# EAGLE schematic Stellmotor_lpc (EAGLE 5.06)
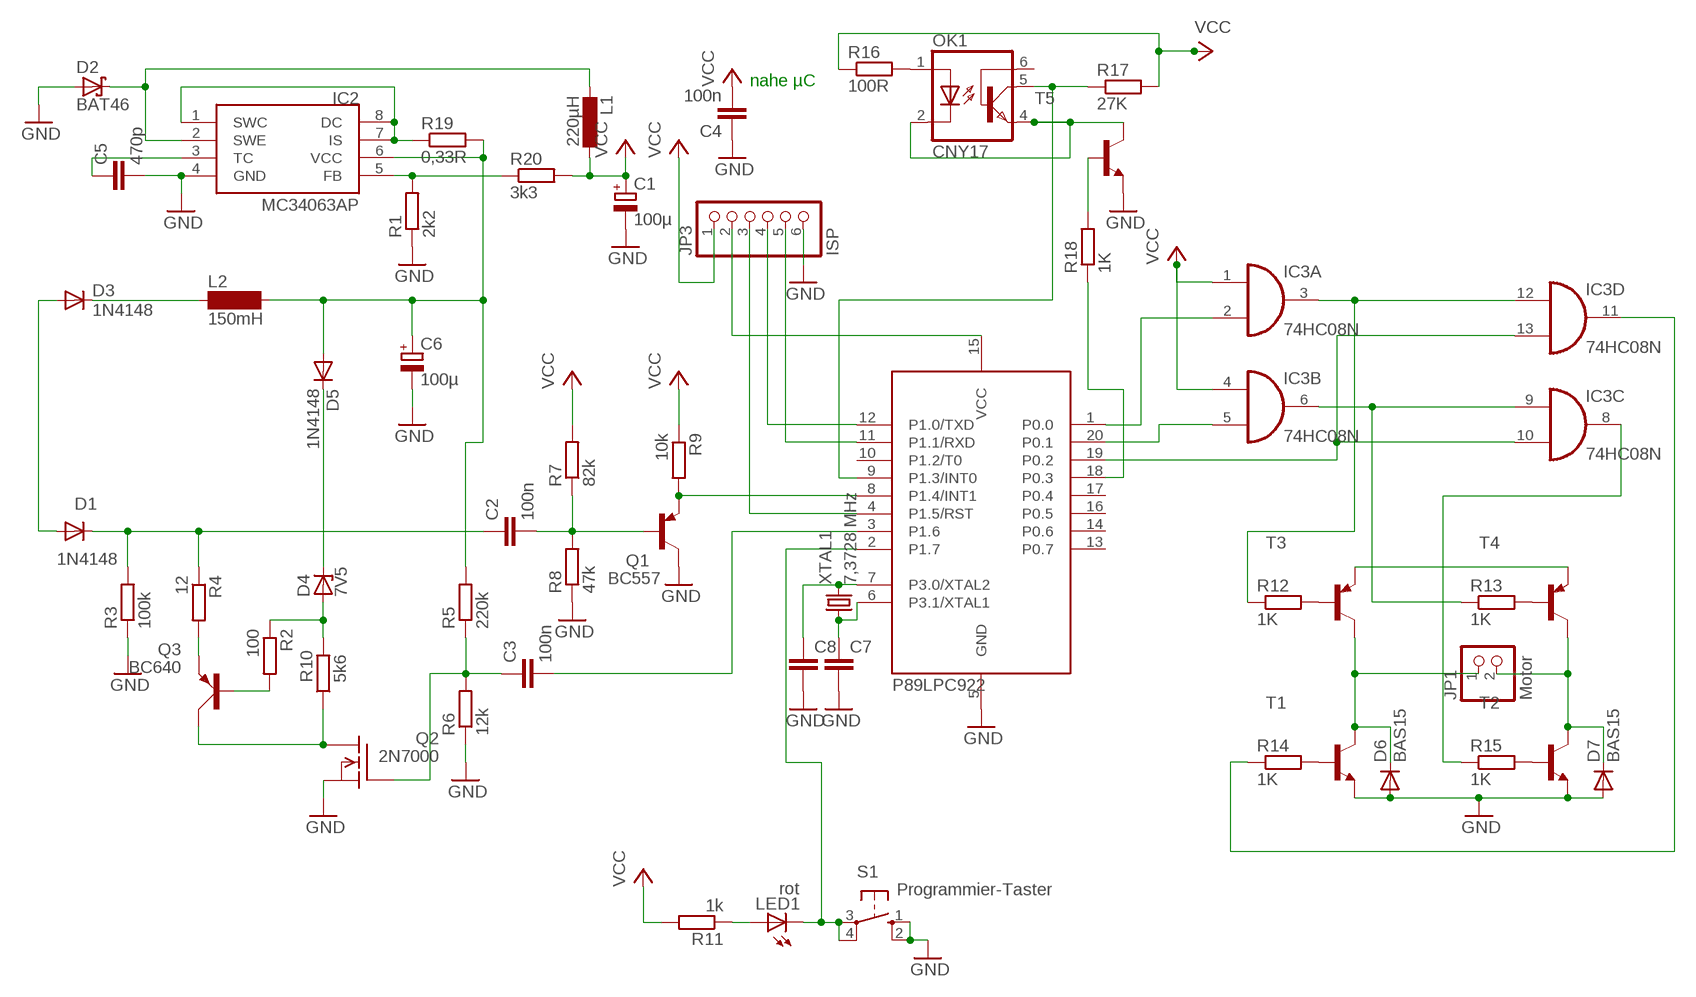
[diagram p0: schematic, sheet 1]

## Parts
C1  100µ  CPOL-EUE5-8.5  [E5-8,5]
C2  100n  C-EU050-024X044  [C050-024X044]
C3  100n  C-EU050-024X044  [C050-024X044]
C4  100n  C-EU050-024X044  [C050-024X044]
C5  470p  C-EU025-024X044  [C025-024X044]
C6  100µ  CPOL-EUE5-8.5  [E5-8,5]
C7  C-EU025-024X044  [C025-024X044]
C8  C-EU025-024X044  [C025-024X044]
D1  1N4148  1N4148DO35-7  [DO35-7]
D2  BAT46  BAT49  [DO41-10]
D3  1N4148  1N4148DO35-7  [DO35-7]
D4  7V5  ZPD  [DO35Z10]
D5  1N4148  1N4148DO35-7  [DO35-7]
D6  BAS15  [DO34-7]
D7  BAS15  [DO34-7]
IC1  89LPC922  [DIL20]
IC2  MC34063AP  [DIL08]
IC3  74HC08N  [DIL14]
JP1  Motor  PINHD-1X2  [1X02]
JP3  ISP  PINHD-1X6  [1X06]
L1  220µH  L-EU2200-12.7  [2200-12.7]
L2  150mH  SD12-1000  [SD12_1000]
LED1  rot  LED3MM  [LED3MM]
OK1  CNY17  [DIL06]
Q1  BC557  [TO92]
Q2  2N7000  VN2222KM  [TO237]
Q3  BC640  [SOT54D]
R1  2k2  R-EU_0207/10  [0207/10]
R2  100  R-EU_0207/10  [0207/10]
R3  100k  R-EU_0207/10  [0207/10]
R4  12  R-EU_0207/10  [0207/10]
R5  220k  R-EU_0207/10  [0207/10]
R6  12k  R-EU_0207/10  [0207/10]
R7  82k  R-EU_0207/10  [0207/10]
R8  47k  R-EU_0207/10  [0207/10]
R9  10k  R-EU_0207/10  [0207/10]
R10  5k6  R-EU_0207/10  [0207/10]
R11  1k  R-EU_0207/10  [0207/10]
R12  1K  R-EU_0207/10  [0207/10]
R13  1K  R-EU_0207/10  [0207/10]
R14  1K  R-EU_0207/10  [0207/10]
R15  1K  R-EU_0207/10  [0207/10]
R16  100R  R-EU_0207/10  [0207/10]
R17  27K  R-EU_0207/10  [0207/10]
R18  1K  R-EU_0207/10  [0207/10]
R19  0,33R  R-EU_0207/10  [0207/10]
R20  3k3  R-EU_0207/10  [0207/10]
S1  Programmier-Taster  10-XX  [B3F-10XX]
T1  BC548C-NPN-TO92-EBC  [TO92-EBC]
T2  BC548C-NPN-TO92-EBC  [TO92-EBC]
T3  BC558C-PNP-TO92-EBC  [TO92-EBC]
T4  BC558C-PNP-TO92-EBC  [TO92-EBC]
T5  BC548C-NPN-TO92-EBC  [TO92-EBC]
XTAL1  7,3728 MHz  CRYSTALHC49S  [HC49/S]

## Nets
GND: C1.- C4.1 C5.2 C6.- C7.2 C8.2 D2.A D6.A D7.A IC1.5(GND) IC2.4(GND) JP3.6 Q1.3(C) Q2.3(S) R1.1 R3.1 R6.1 R8.1 S1.1(S) S1.2(S1) T1.E T2.E T5.E
N$1: IC1.8(P1.4/INT1) Q1.1(E) R9.2
N$2: C2.2 Q1.2(B) R7.1 R8.2
N$3: IC2.5(FB) R1.2 R20.1
N$4: IC2.1(SWC) IC2.7(IS) IC2.8(DC) R19.1
N$5: C3.2 IC1.3(P1.6)
N$6: Q2.1(D) Q3.C R10.1
N$7: C6.+ D5.A IC2.6(VCC) L2.2 R5.2 R19.2
N$8: D3.C L2.1
N$9: C2.1 D1.C R3.2 R4.1
N$10: D2.C IC2.2(SWE) L1.2
N$11: D4.A R2.1 R10.2
N$12: Q3.E R4.2
N$13: C5.1 IC2.3(TC)
N$14: Q3.B R2.2
N$15: IC3.6(B:O) IC3.9(C:I0) R13.1
N$16: D1.A D3.A
N$17: IC1.2(P1.7) LED1.K(C) S1.3(P) S1.4(P1)
N$18: IC3.3(A:O) IC3.12(D:I0) R12.1
N$19: IC1.1(P0.0) IC3.2(A:I1)
N$20: C8.1 IC1.7(P3.0/XTAL2) XTAL1.2
N$21: C7.1 IC1.6(P3.1/XTAL1) XTAL1.1
N$22: OK1.1(A) R16.2
N$23: IC1.20(P0.1) IC3.5(B:I1)
N$24: D6.C JP1.1 T1.C T3.C
N$25: D7.C JP1.2 T2.C T4.C
N$26: IC1.9(P1.3/INT0) OK1.5(COL) R17.1
N$27: T3.E T4.E
N$28: R12.2 T3.B
N$29: IC1.12(P1.0/TXD) JP3.4
N$30: IC1.11(P1.1/RXD) JP3.5
N$31: IC1.4(P1.5/RST) JP3.3
N$32: IC1.15(VCC) JP3.2
N$33: R13.2 T4.B
N$34: C3.1 Q2.2(G) R5.1 R6.2
N$35: R14.2 T1.B
N$36: R15.2 T2.B
N$37: IC1.19(P0.2) IC3.10(C:I1) IC3.13(D:I1)
N$38: OK1.2(C) OK1.4(EMI) T5.C
N$39: IC3.8(C:O) R15.1
N$40: D4.C D5.C
N$41: LED1.A R11.1
N$42: IC3.11(D:O) R14.1
N$43: IC1.18(P0.3) R18.1
N$44: R18.2 T5.B
VCC: C1.+ C4.2 IC3.1(A:I0) IC3.4(B:I0) JP3.1 L1.1 R7.2 R9.1 R11.2 R16.1 R17.2 R20.2
Unconnected: IC1.10(P1.2/T0) IC1.13(P0.7) IC1.14(P0.6) IC1.16(P0.5) IC1.17(P0.4) OK1.6(BAS)

## Notes on the sheet
- nahe µC
- P89LPC922

## Power pins joined to a net without a drawn wire
GND: IC3.7(P:GND)
VCC: IC3.14(P:VCC)

## Library data of the parts
C1 C6 = rcl:CPOL-EU: POLARIZED CAPACITOR, European symbol
C2-C5 C7 C8 = rcl:C-EU: CAPACITOR, European symbol
D1 D3 D5 = diode:1N4148: DIODE high speed (Philips)
D2 = diode:BAT49: DIODE small signal diode
D4 = diode:ZPD: Z DIODE 500 mW
D6 D7 = diode:BAS15: DIODE high speed
IC1 = micro-philips:89LPC922
IC2 = mc34063:MC34063
IC3 = 74xx-eu:74*08: Quad 2-input AND gate
JP1 = pinhead:PINHD-1X2: PIN HEADER
JP3 = pinhead:PINHD-1X6: PIN HEADER
L1 = rcl:L-EU: INDUCTOR, European symbol
L2 = inductor-neosid:SD12: INDUCTOR nominal inductance
LED1 = led:LED: LED OSRAM: - CHIPLED LG R971, LG N971, LY N971, LG Q971, LY Q971, LO R971, LY R971 LH N974, LH R974 LS Q976, LO Q976, LY Q976 LO Q996 - Hyper CHIPLED LW Q18S LB Q993, LB Q99A, LB R99A - SideLED LS A670, LO A670, LY A670, LG A670, LP A670 LB A673, LV A673, LT A673, LW A673 LH A674 LY A675 LS A676, LA A676, LO A676, LY A676, LW A676 LS A679, LY A679, LG A679 - Hyper Micro SIDELED® LS Y876, LA Y876, LO Y876, LY Y876 LT Y87S - SmartLED LW L88C, LW L88S LB L89C, LB L89S, LG L890 LS L89K, LO L89K, LY L89K LS L896, LA L896, LO L896, LY L896 - TOPLED LS T670, LO T670, LY T670, LG T670, LP T670 LSG T670, LSP T670, LSY T670, LOP T670, LYG T670 LG T671, LOG T671, LSG T671 LB T673, LV T673, LT T673, LW T673 LH T674 LS T676, LA T676, LO T676, LY T676, LB T676, LH T676, LSB T676, LW T676 LB T67C, LV T67C, LT T67C, LS T67K, LO T67K, LY T67K, LW E67C LS E67B, LA E67B, LO E67B, LY E67B, LB E67C, LV E67C, LT E67C LW T67C LS T679, LY T679, LG T679 LS T770, LO T770, LY T770, LG T770, LP T770 LB T773, LV T773, LT T773, LW T773 LH T774 LS E675, LA E675, LY E675, LS T675 LS T776, LA T776, LO T776, LY T776, LB T776 LHGB T686 LT T68C, LB T68C - Hyper Mini TOPLED® LB M676 - Mini TOPLED Santana® LG M470 LS M47K, LO M47K, LY M47K Source: http://www.osram.convergy.de - LUMILED® LXK2-PW12-R00, LXK2-PW12-S00, LXK2-PW14-U00, LXK2-PW14-V00 LXK2-PM12-R00, LXK2-PM12-S00, LXK2-PM14-U00 LXK2-PE12-Q00, LXK2-PE12-R00, LXK2-PE12-S00, LXK2-PE14-T00, LXK2-PE14-U00 LXK2-PB12-K00, LXK2-PB12-L00, LXK2-PB12-M00, LXK2-PB14-N00, LXK2-PB14-P00, LXK2-PB14-Q00 LXK2-PR12-L00, LXK2-PR12-M00, LXK2-PR14-Q00, LXK2-PR14-R00 LXK2-PD12-Q00, LXK2-PD12-R00, LXK2-PD12-S00 LXK2-PH12-R00, LXK2-PH12-S00 LXK2-PL12-P00, LXK2-PL12-Q00, LXK2-PL12-R00 Source: www.luxeon.com
OK1 = optocoupler:CNY17: SIEMENS OPTO COUPLER
Q1 = transistor-pnp:BC557: PNP Transistor
Q2 = transistor-fet:VN2222KM: N-Channel Enhancement MOSFET (VMOS); 60V; 0,5A; 7,5Ohm
Q3 = transistor-small-signal:BC640: PNP TRANSISTOR
R1-R20 = rcl:R-EU_: RESISTOR, European symbol
S1 = switch-omron:10-XX: OMRON SWITCH
T1 T2 T5 = transistor:*-NPN-: NPN Transistror BF959 corrected 2008.03.06
T3 T4 = transistor:*-PNP-: PNP Transistror
XTAL1 = crystal:CRYSTAL: CRYSTAL